# Altium schematic sheet ST_Link.SchDoc: Płytka rozwojowa STM
size A4; Author1: Łukasz Wawrzyniak; Organization: Politechnika Łódzka; Address1: WEEIA; Address2: Elektronika i Telekomunikacja; Address3: Semestr zimowy 2021/2022; Address4: Stopień II; Revision: -; SheetNumber: 3; SheetTotal: 7; Author2: Mateusz Melka; Title2: Zaawansowane narzędzia CAD/EDA; Author5: Maciej Figiel; Author4: Michał Skurpel; Author3: Jakub Korzeniowski; Index1: 239499; Index2: 239488; Index3: 239436; Index4: 239457; Index5: 239473
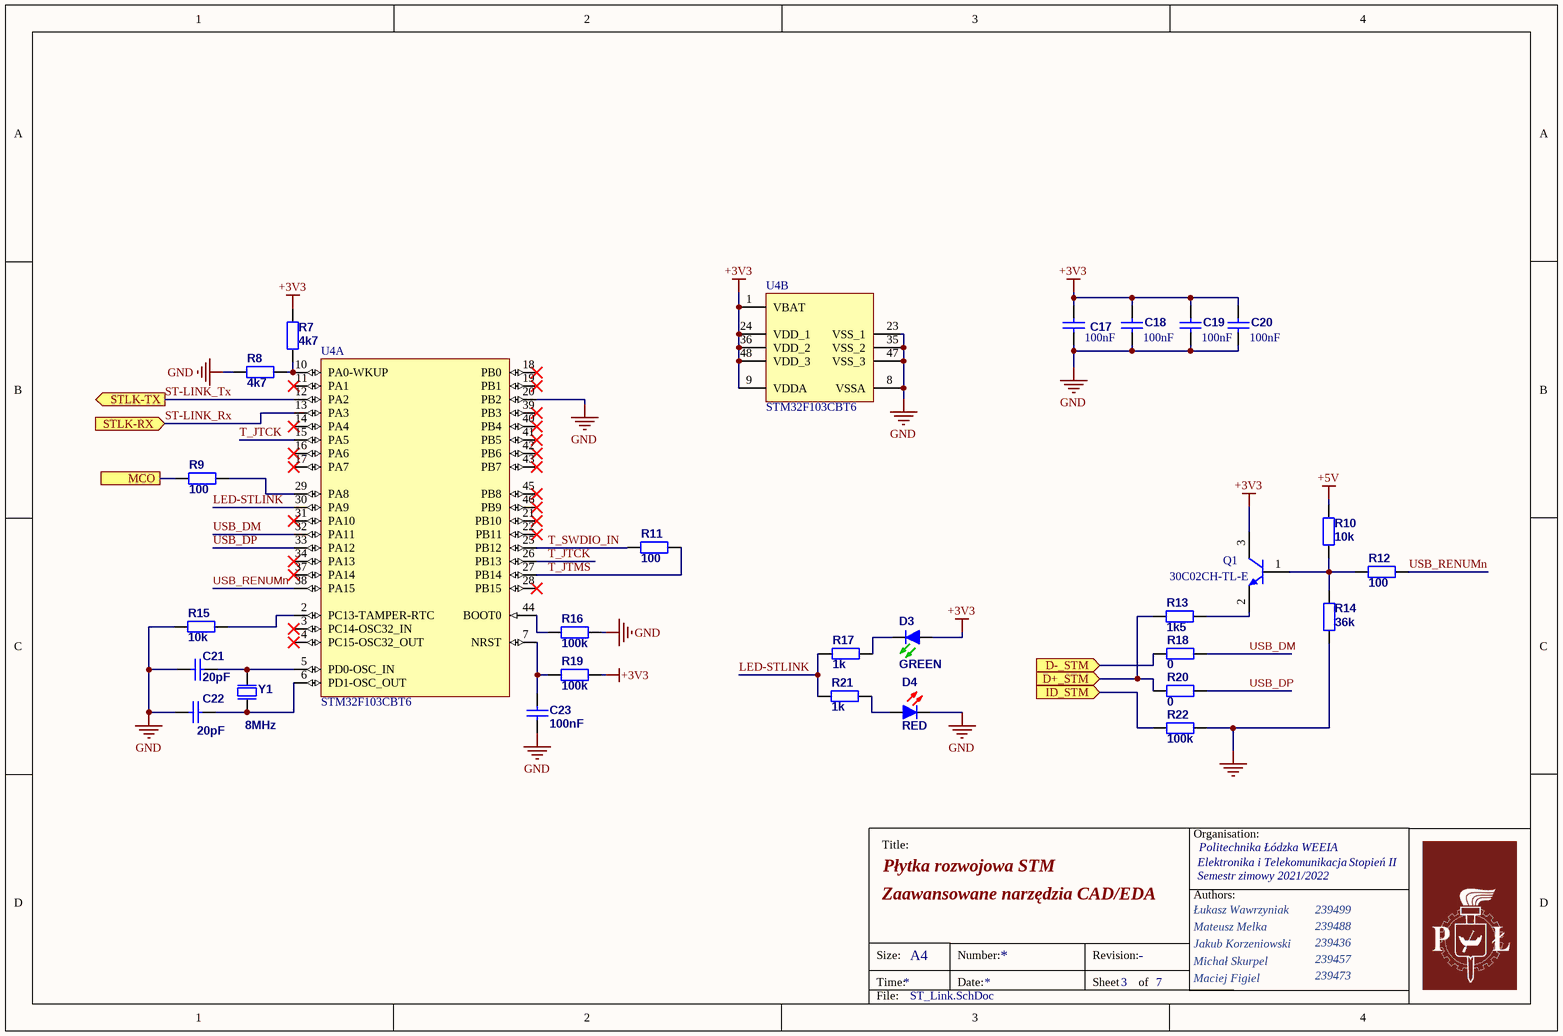
[diagram p0: ST_Link.SchDoc]

## Parts
C17  100nF  [0805]
C18  100nF  [0805]
C19  100nF  [0805]
C20  100nF  [0805]
C21  20pF  [0805]
C22  20pF  [0805]
C23  100nF  [0805]
D3  GREEN  [LED1206G]
D4  RED  [LED1206R]
Q1  30C02CH-TL-E  [ONSC-CPH-3_V]
R7  4k7  [0805]
R8  4k7  [0805]
R9  100  [0805]
R10  10k  [0805]
R11  100  [0805]
R12  100  [0805]
R13  1k5  [0805]
R14  36k  [0805]
R15  10k  [0805]
R16  100k  [0805]
R17  1k  [0805]
R18  0  [0805]
R19  100k  [0805]
R20  0  [0805]
R21  1k  [0805]
R22  100k  [0805]
U4  STM32F103CBT6  [STM-LQFP48_L]  (parts A,B of 2)
Y1  8MHz  [HC49/4H]

## Ports
D+_STM (in), D-_STM (in), ID_STM (in), MCO, STLK-RX (in), STLK-TX (out)

## Nets
+3V3: C17.2 C18.2 C19.2 C20.2 D3.1(A) Q1.3(C) R7.1 R19.1 U4.1(VBAT) U4.9(VDDA) U4.24(VDD_1) U4.36(VDD_2) U4.48(VDD_3)
+5V: R10.2
GND: C17.1 C18.1 C19.1 C20.1 C21.1 C22.1 C23.1 D4.2(K) R8.2 R14.2 R15.2 R16.1 R22.1 U4.8(VSSA) U4.20(PB2) U4.23(VSS_1) U4.35(VSS_2) U4.47(VSS_3)
D+_STM: R13.2 R20.2 ; port D+_STM
D-_STM: R18.2 ; port D-_STM
ID_STM: R22.2 ; port ID_STM
LED-STLINK: R17.2 R21.2 U4.30(PA9)
MCO: R9.2 ; port MCO
ST-LINK_Rx: U4.13(PA3) ; port STLK-RX
ST-LINK_Tx: U4.12(PA2) ; port STLK-TX
T_JTCK: U4.15(PA5) U4.26(PB13)
T_JTMS: R11.1 U4.27(PB14)
T_SWDIO_IN: R11.2 U4.25(PB12)
USB_DM: R18.1 U4.32(PA11)
USB_DP: R20.1 U4.33(PA12)
USB_RENUMn: R12.2 U4.38(PA15)
NetC21_2: C21.2 U4.5(PD0-OSC_IN) Y1.2(OSC2)
NetC22_2: C22.2 U4.6(PD1-OSC_OUT) Y1.1(OSC1)
NetC23_2: C23.2 R19.2 U4.7(NRST)
NetD3_2: D3.2(K) R17.1
NetD4_1: D4.1(A) R21.1
NetQ1_1: Q1.1(B) R10.1 R12.1 R14.1
NetQ1_2: Q1.2(E) R13.1
NetR7_2: R7.2 R8.1 U4.10(PA0-WKUP)
NetR9_1: R9.1 U4.29(PA8)
NetR15_1: R15.1 U4.2(PC13-TAMPER-RTC)
NetR16_2: R16.2 U4.44(BOOT0)

Not connected (* = marked no-connect by the designer): U4 3(PC14-OSC32_IN)* 4(PC15-OSC32_OUT)* 11(PA1)* 14(PA4)* 16(PA6)* 17(PA7)* 18(PB0)* 19(PB1)* 21(PB10)* 22(PB11)* 28(PB15)* 31(PA10)* 34(PA13)* 37(PA14)* 39(PB3)* 40(PB4)* 41(PB5)* 42(PB6)* 43(PB7)* 45(PB8)* 46(PB9)*

## Notes on the sheet
- Title:
- Organisation:
- Authors:
- Size:
- Time:
- A4
- Number:
- Date:
- Revision:
- Sheet
- of
- File:

## Library data of the parts
C17-C22 = Cap: Ceramic capacitor MLCC SMD ±1%; ComponentLink1Description: datasheet; ComponentLink2Description: supplier
  C17-C20: Value: 100nF
  C21 C22: Value: 20pF
C23 = Cap: Ceramic capacitor MLCC SMD ±5%; ComponentLink1Description: datasheet; ComponentLink2Description: supplier; Value: 100nF
D3 = LED_GREEN: GREEN LED; Published: 04-Apr-2006
D4 = LED_RED: RED LED; Published: 04-Apr-2006
Q1 = CMP-1048-00073-1: Bipolar Transistor,, Low VCE(sat), NPN Single, 3-Pin CPH, Pb-Free, Tape and Reel; Manufacturer: On Semiconductor; IC Continuous (A): 0.7; Current: 0.7 A; Voltage: 30 V; PackageDescription: 3-Pin Small Outline Transistor, Body 2.9 x 1.6 mm, Pitch 0.95 mm; Mounting Technology: Surface Mount; ComponentLink3Description: Package Specification; ComponentLink2URL: http://www.onsemi.com/pub_link/Collateral/30C02CH-D.PDF; ComponentLink1Description: Manufacturer URL; ComponentLink2Description: Datasheet; Polarity: NPN; ComponentLink3URL: http://www.onsemi.com/pub_link/Collateral/50A02CH-D.PDF; ComponentLink1URL: http://www.onsemi.com/; PackageReference: CPH-3; RoHS: TRUE; PartNumber: 30C02CH-TL-E; Packing: Tape and Reel; Footprint: SC; Footprint model: https://octopart.com/30c02ch-tl-e-onsemi-20815499?r=sp#Specs; 3D model: https://octopart.com/30c02ch-tl-e-onsemi-20815499?r=sp#Specs; Shop link: Digi-Key: @30C02CH-TL-EOSTR-ND
R7-R22 = Res: Resistor SMD  ±5%; Published: 19-Feb-2006; ComponentLink1Description: datasheet; ComponentLink2Description: supplier
  R7 R8: Value: 4k7
  R9 R11 R12: Value: 100
  R10 R15: Value: 10k
  R13: Value: 1k5
  R14: Value: 36k
  R16 R19 R22: Value: 100k
  R17 R21: Value: 1k
  R18 R20: Value: 0
U4 = CMP-0237-00250-3: ARM Cortex-M3 32-bit MCU, 128 KB Flash, 20 KB Internal RAM, 37 I/Os, 48-pin LQFP, -40 to 85 degC, Tray; Supply Voltage(Vcc) min (V): 2; Operating Frequency(F) (Processor speed) (MHz): 72; A/D Converter: 2x12-bit (10 Channel); FLASH Size (Prog) (kB): 128; Internal RAM Size (kB): 20; I/Os (High Current): 37; Voltage: 3.3V; ComponentLink2Description: Datasheet; PackageReference: LQFP48; PartNumber: STM32F103CBT6; ComponentLink1Description: Manufacturer URL; DatasheetVersion: Rev. 16; PackageVersion: Rev. 6, 06/2013; Packing: Tray; ComponentLink1URL: http://www.st.com/web/en/home.html; Mounting Technology: Surface Mount; ComponentLink3URL: http://www.st.com/st-web-ui/static/active/en/resource/technical/document/datasheet/DM00058181.pdf; PackageDescription: 48-Pin Low Profile Quad Flat Package, 7 x 7 mm Body, 0.5 mm Pitch; Core: ARM Cortex-M3; ComponentLink3Description: Package Specification; ComponentLink2URL: http://www.st.com/st-web-ui/static/active/en/resource/technical/document/datasheet/CD00161566.pdf; Footprint: LQFP; Footprint model: https://octopart.com/stm32f103cbt6-stmicroelectronics-7868657?r=sp#Specs; 3D model: https://octopart.com/stm32f103cbt6-stmicroelectronics-7868657?r=sp#Specs; Shop link: Digi-Key: @497-6288-ND
Y1 = XTAL_2PIN: Crystal Oscillator (20pF); ComponentLink1Description: datasheet; ComponentLink2Description: supplier; Value: *